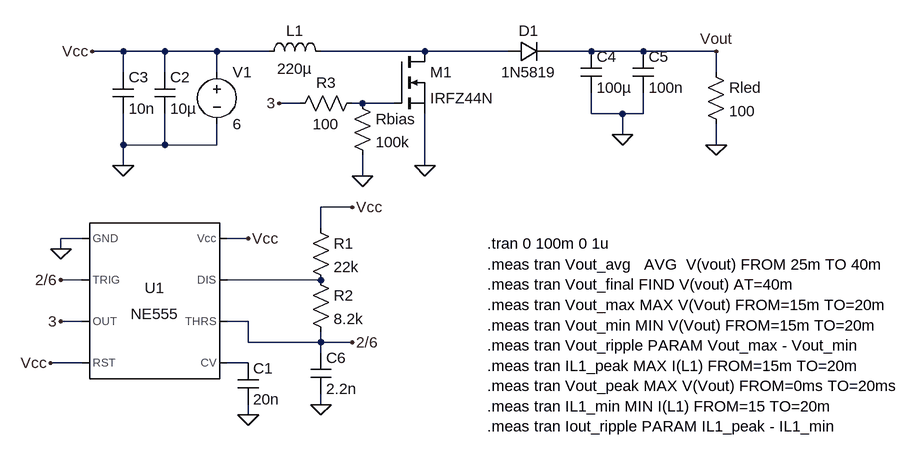
[diagram p0: schematic Boost_Converter_6v.asc]
Boost_Converter_6v.asc, the LTspice schematic file:
Version 4.1
SHEET 1 1236 680
WIRE 0 -160 -48 -160
WIRE 64 -160 0 -160
WIRE 144 -160 64 -160
WIRE 224 -160 144 -160
WIRE 464 -160 304 -160
WIRE 592 -160 464 -160
WIRE 720 -160 656 -160
WIRE 800 -160 720 -160
WIRE 912 -160 800 -160
WIRE 0 -128 0 -160
WIRE 64 -128 64 -160
WIRE 144 -128 144 -160
WIRE 912 -128 912 -160
WIRE 272 -80 240 -80
WIRE 368 -80 352 -80
WIRE 416 -80 368 -80
WIRE 720 -64 720 -96
WIRE 768 -64 720 -64
WIRE 800 -64 800 -96
WIRE 800 -64 768 -64
WIRE 768 -32 768 -64
WIRE 0 -16 0 -64
WIRE 64 -16 64 -64
WIRE 64 -16 0 -16
WIRE 144 -16 144 -48
WIRE 144 -16 64 -16
WIRE 912 -16 912 -48
WIRE 0 16 0 -16
WIRE 464 16 464 -64
WIRE 368 32 368 0
WIRE 352 80 304 80
WIRE 304 112 304 80
WIRE -64 128 -96 128
WIRE 192 128 160 128
WIRE -96 144 -96 128
WIRE -64 192 -96 192
WIRE 304 192 160 192
WIRE -64 256 -96 256
WIRE 192 256 160 256
WIRE 192 288 192 256
WIRE 304 288 304 272
WIRE 304 288 192 288
WIRE 352 288 304 288
WIRE 304 304 304 288
WIRE -64 320 -112 320
WIRE 192 320 160 320
WIRE 304 384 304 368
WIRE 192 400 192 384
FLAG -96 144 0
FLAG 192 128 Vcc
FLAG -112 320 Vcc
FLAG -96 192 2/6
FLAG -96 256 3
FLAG 192 400 0
FLAG 0 16 0
FLAG -48 -160 Vcc
FLAG 240 -80 3
FLAG 368 32 0
FLAG 464 16 0
FLAG 768 -32 0
FLAG 304 384 0
FLAG 912 -16 0
FLAG 912 -160 Vout
FLAG 352 80 Vcc
FLAG 352 288 2/6
SYMBOL Misc\\NE555 48 224 R0
SYMATTR InstName U1
SYMBOL cap 176 320 R0
SYMATTR InstName C1
SYMATTR Value 20n
SYMBOL res 288 96 R0
SYMATTR InstName R1
SYMATTR Value 22k
SYMBOL res 288 176 R0
SYMATTR InstName R2
SYMATTR Value 8.2k
SYMBOL voltage 144 -144 R0
SYMATTR InstName V1
SYMATTR Value 6
SYMBOL cap 48 -128 R0
SYMATTR InstName C2
SYMATTR Value 10µ
SYMBOL cap -16 -128 R0
SYMATTR InstName C3
SYMATTR Value 10n
SYMBOL ind 208 -144 R270
WINDOW 0 32 56 VTop 2
WINDOW 3 5 56 VBottom 2
SYMATTR InstName L1
SYMATTR Value 220µ
SYMBOL nmos 416 -160 R0
SYMATTR InstName M1
SYMATTR Value IRFZ44N
SYMBOL res 368 -96 R90
WINDOW 0 0 56 VBottom 2
WINDOW 3 32 56 VTop 2
SYMATTR InstName R3
SYMATTR Value 100
SYMBOL res 352 -96 R0
SYMATTR InstName Rbias
SYMATTR Value 100k
SYMBOL diode 592 -144 R270
WINDOW 0 32 32 VTop 2
WINDOW 3 0 32 VBottom 2
SYMATTR InstName D1
SYMATTR Value 1N5819
SYMBOL cap 704 -160 R0
SYMATTR InstName C4
SYMATTR Value 100µ
SYMBOL cap 784 -160 R0
SYMATTR InstName C5
SYMATTR Value 100n
SYMBOL cap 288 304 R0
SYMATTR InstName C6
SYMATTR Value 2.2n
SYMBOL res 896 -144 R0
SYMATTR InstName Rled
SYMATTR Value 100
TEXT 560 136 Left 2 !.tran 0 100m 0 1u
TEXT 560 168 Left 2 !.meas tran Vout_avg   AVG  V(vout) FROM 25m TO 40m\n.meas tran Vout_final FIND V(vout) AT=40m\n.meas tran Vout_max MAX V(Vout) FROM=15m TO=20m\n.meas tran Vout_min MIN V(Vout) FROM=15m TO=20m\n.meas tran Vout_ripple PARAM Vout_max - Vout_min\n.meas tran IL1_peak MAX I(L1) FROM=15m TO=20m\n.meas tran Vout_peak MAX V(Vout) FROM=0ms TO=20ms\n.meas tran IL1_min MIN I(L1) FROM=15 TO=20m\n.meas tran Iout_ripple PARAM IL1_peak - IL1_min

The netlist it stands for:
* Boost_Converter_6v.asc
X§U1 0 2/6 3 Vcc N004 2/6 N003 Vcc NE555  ; pins GND TRIG OUT RST CV THRS DIS Vcc
C1 N004 0 20n
R1 Vcc N003 22k
R2 N003 2/6 8.2k
V1 Vcc 0 6
C2 Vcc 0 10µ
C3 Vcc 0 10n
L1 Vcc N001 220µ
M1 N001 N002 0 0 IRFZ44N
R3 N002 3 100
Rbias N002 0 100k
D1 N001 Vout 1N5819
C4 Vout 0 100µ
C5 Vout 0 100n
C6 2/6 0 2.2n
Rled Vout 0 100
.model D D
.lib standard.dio
.model NMOS NMOS
.model PMOS PMOS
.lib standard.mos
.tran 0 100m 0 1u
.meas tran Vout_avg   AVG  V(vout) FROM 25m TO 40m
.meas tran Vout_final FIND V(vout) AT=40m
.meas tran Vout_max MAX V(Vout) FROM=15m TO=20m
.meas tran Vout_min MIN V(Vout) FROM=15m TO=20m
.meas tran Vout_ripple PARAM Vout_max - Vout_min
.meas tran IL1_peak MAX I(L1) FROM=15m TO=20m
.meas tran Vout_peak MAX V(Vout) FROM=0ms TO=20ms
.meas tran IL1_min MIN I(L1) FROM=15 TO=20m
.meas tran Iout_ripple PARAM IL1_peak - IL1_min
.lib NE555.sub
.backanno
.end